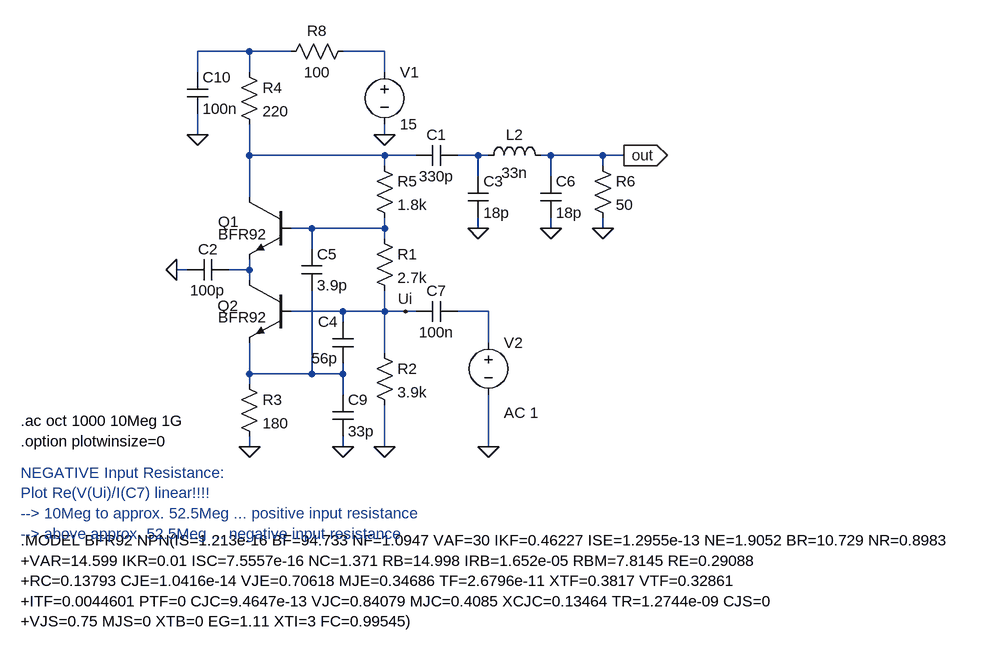
[diagram p0: schematic Neg_Input_Res.asc]
Neg_Input_Res.asc, the LTspice schematic file:
Version 4
SHEET 1 1040 748
WIRE -16 240 -32 240
WIRE 0 -64 0 -96
WIRE 0 32 0 0
WIRE 80 -96 0 -96
WIRE 80 -64 80 -96
WIRE 80 64 80 16
WIRE 80 128 80 64
WIRE 80 240 48 240
WIRE 80 240 80 224
WIRE 80 256 80 240
WIRE 80 400 80 352
WIRE 80 416 80 400
WIRE 80 512 80 496
WIRE 144 -96 80 -96
WIRE 176 176 144 176
WIRE 176 208 176 176
WIRE 176 400 80 400
WIRE 176 400 176 272
WIRE 224 304 144 304
WIRE 224 320 224 304
WIRE 224 400 176 400
WIRE 224 400 224 384
WIRE 224 432 224 400
WIRE 224 512 224 496
WIRE 288 -96 224 -96
WIRE 288 -64 288 -96
WIRE 288 32 288 16
WIRE 288 64 80 64
WIRE 288 80 288 64
WIRE 288 176 176 176
WIRE 288 176 288 160
WIRE 288 192 288 176
WIRE 288 304 224 304
WIRE 288 304 288 272
WIRE 288 368 288 304
WIRE 288 512 288 448
WIRE 320 304 288 304
WIRE 336 64 288 64
WIRE 336 304 320 304
WIRE 432 64 400 64
WIRE 432 96 432 64
WIRE 432 176 432 160
WIRE 448 64 432 64
WIRE 448 304 400 304
WIRE 448 352 448 304
WIRE 448 512 448 432
WIRE 544 64 528 64
WIRE 544 96 544 64
WIRE 544 176 544 160
WIRE 624 64 544 64
WIRE 624 80 624 64
WIRE 624 176 624 160
WIRE 656 64 624 64
FLAG 288 32 0
FLAG 80 512 0
FLAG 288 512 0
FLAG -32 240 0
FLAG 224 512 0
FLAG 624 176 0
FLAG 656 64 out
IOPIN 656 64 Out
FLAG 432 176 0
FLAG 544 176 0
FLAG 0 32 0
FLAG 448 512 0
FLAG 320 304 Ui
SYMBOL res 272 176 R0
SYMATTR InstName R1
SYMATTR Value 2.7k
SYMBOL res 272 352 R0
SYMATTR InstName R2
SYMATTR Value 3.9k
SYMBOL res 64 400 R0
SYMATTR InstName R3
SYMATTR Value 180
SYMBOL res 64 -80 R0
SYMATTR InstName R4
SYMATTR Value 220
SYMBOL res 272 64 R0
SYMATTR InstName R5
SYMATTR Value 1.8k
SYMBOL voltage 288 -80 R0
WINDOW 123 0 0 Left 0
WINDOW 39 0 0 Left 0
SYMATTR InstName V1
SYMATTR Value 15
SYMBOL cap 48 224 R90
WINDOW 0 0 32 VBottom 0
WINDOW 3 32 32 VTop 0
SYMATTR InstName C2
SYMATTR Value 100p
SYMBOL cap 240 384 R180
WINDOW 0 24 64 Left 0
WINDOW 3 24 8 Left 0
SYMATTR InstName C4
SYMATTR Value 56p
SYMBOL cap 160 208 R0
SYMATTR InstName C5
SYMATTR Value 3.9p
SYMBOL cap 208 432 R0
SYMATTR InstName C9
SYMATTR Value 33p
SYMBOL cap 400 48 R90
WINDOW 0 0 32 VBottom 0
WINDOW 3 32 32 VTop 0
SYMATTR InstName C1
SYMATTR Value 330p
SYMBOL res 608 64 R0
SYMATTR InstName R6
SYMATTR Value 50
SYMBOL npn 144 128 M0
WINDOW 0 112 38 Right 0
WINDOW 3 112 57 Right 0
SYMATTR InstName Q1
SYMATTR Value BFR92
SYMBOL npn 144 256 M0
WINDOW 0 113 39 Right 0
WINDOW 3 112 57 Right 0
SYMATTR InstName Q2
SYMATTR Value BFR92
SYMBOL cap 416 96 R0
SYMATTR InstName C3
SYMATTR Value 18p
SYMBOL ind 432 80 R270
WINDOW 0 32 56 VTop 0
WINDOW 3 5 56 VBottom 0
SYMATTR InstName L2
SYMATTR Value 33n
SYMATTR SpiceLine Rser=1
SYMBOL cap 528 96 R0
SYMATTR InstName C6
SYMATTR Value 18p
SYMBOL res 240 -112 R90
WINDOW 0 0 56 VBottom 0
WINDOW 3 32 56 VTop 0
SYMATTR InstName R8
SYMATTR Value 100
SYMBOL cap -16 -64 R0
SYMATTR InstName C10
SYMATTR Value 100n
SYMBOL cap 400 288 R90
WINDOW 0 0 32 VBottom 0
WINDOW 3 32 32 VTop 0
SYMATTR InstName C7
SYMATTR Value 100n
SYMBOL voltage 448 336 R0
WINDOW 123 24 124 Left 0
WINDOW 39 0 0 Left 0
SYMATTR Value2 AC 1
SYMATTR InstName V2
SYMATTR Value ""
TEXT -272 504 Left 0 !.option plotwinsize=0
TEXT -272 656 Left 0 !.MODEL BFR92 NPN(IS=1.213e-16 BF=94.733 NF=1.0947 VAF=30 IKF=0.46227 ISE=1.2955e-13 NE=1.9052 BR=10.729 NR=0.8983\n+VAR=14.599 IKR=0.01 ISC=7.5557e-16 NC=1.371 RB=14.998 IRB=1.652e-05 RBM=7.8145 RE=0.29088\n+RC=0.13793 CJE=1.0416e-14 VJE=0.70618 MJE=0.34686 TF=2.6796e-11 XTF=0.3817 VTF=0.32861\n+ITF=0.0044601 PTF=0 CJC=9.4647e-13 VJC=0.84079 MJC=0.4085 XCJC=0.13464 TR=1.2744e-09 CJS=0\n+VJS=0.75 MJS=0 XTB=0 EG=1.11 XTI=3 FC=0.99545)
TEXT -272 472 Left 0 !.ac oct 1000 10Meg 1G
TEXT -272 552 Left 0 ;NEGATIVE Input Resistance:\nPlot Re(V(Ui)/I(C7) linear!!!!\n--> 10Meg to approx. 52.5Meg ... positive input resistance\n--> above approx. 52.5Meg ... negative input resistance

The netlist it stands for:
* Neg_Input_Res.asc
R1 N005 Ui 2.7k
R2 Ui 0 3.9k
R3 N004 0 180
R4 N001 N002 220
R5 N002 N005 1.8k
V1 N006 0 15
C2 N003 0 100p
C4 N004 Ui 56p
C5 N005 N004 3.9p
C9 N004 0 33p
C1 N007 N002 330p
R6 out 0 50
Q1 N002 N005 N003 0 BFR92
Q2 N003 Ui N004 0 BFR92
C3 N007 0 18p
L2 N007 out 33n Rser=1
C6 out 0 18p
R8 N006 N001 100
C10 N001 0 100n
C7 N008 Ui 100n
V2 N008 0 AC 1
.model NPN NPN
.model PNP PNP
.lib standard.bjt
.option plotwinsize=0
.MODEL BFR92 NPN(IS=1.213e-16 BF=94.733 NF=1.0947 VAF=30 IKF=0.46227 ISE=1.2955e-13 NE=1.9052 BR=10.729 NR=0.8983
+VAR=14.599 IKR=0.01 ISC=7.5557e-16 NC=1.371 RB=14.998 IRB=1.652e-05 RBM=7.8145 RE=0.29088
+RC=0.13793 CJE=1.0416e-14 VJE=0.70618 MJE=0.34686 TF=2.6796e-11 XTF=0.3817 VTF=0.32861
+ITF=0.0044601 PTF=0 CJC=9.4647e-13 VJC=0.84079 MJC=0.4085 XCJC=0.13464 TR=1.2744e-09 CJS=0
+VJS=0.75 MJS=0 XTB=0 EG=1.11 XTI=3 FC=0.99545)
.ac oct 1000 10Meg 1G
* NEGATIVE Input Resistance:
* Plot Re(V(Ui)/I(C7) linear!!!!
* --> 10Meg to approx. 52.5Meg ... positive input resistance
* --> above approx. 52.5Meg ... negative input resistance
.backanno
.end